# EAGLE design main_board (EAGLE 9.5.2)
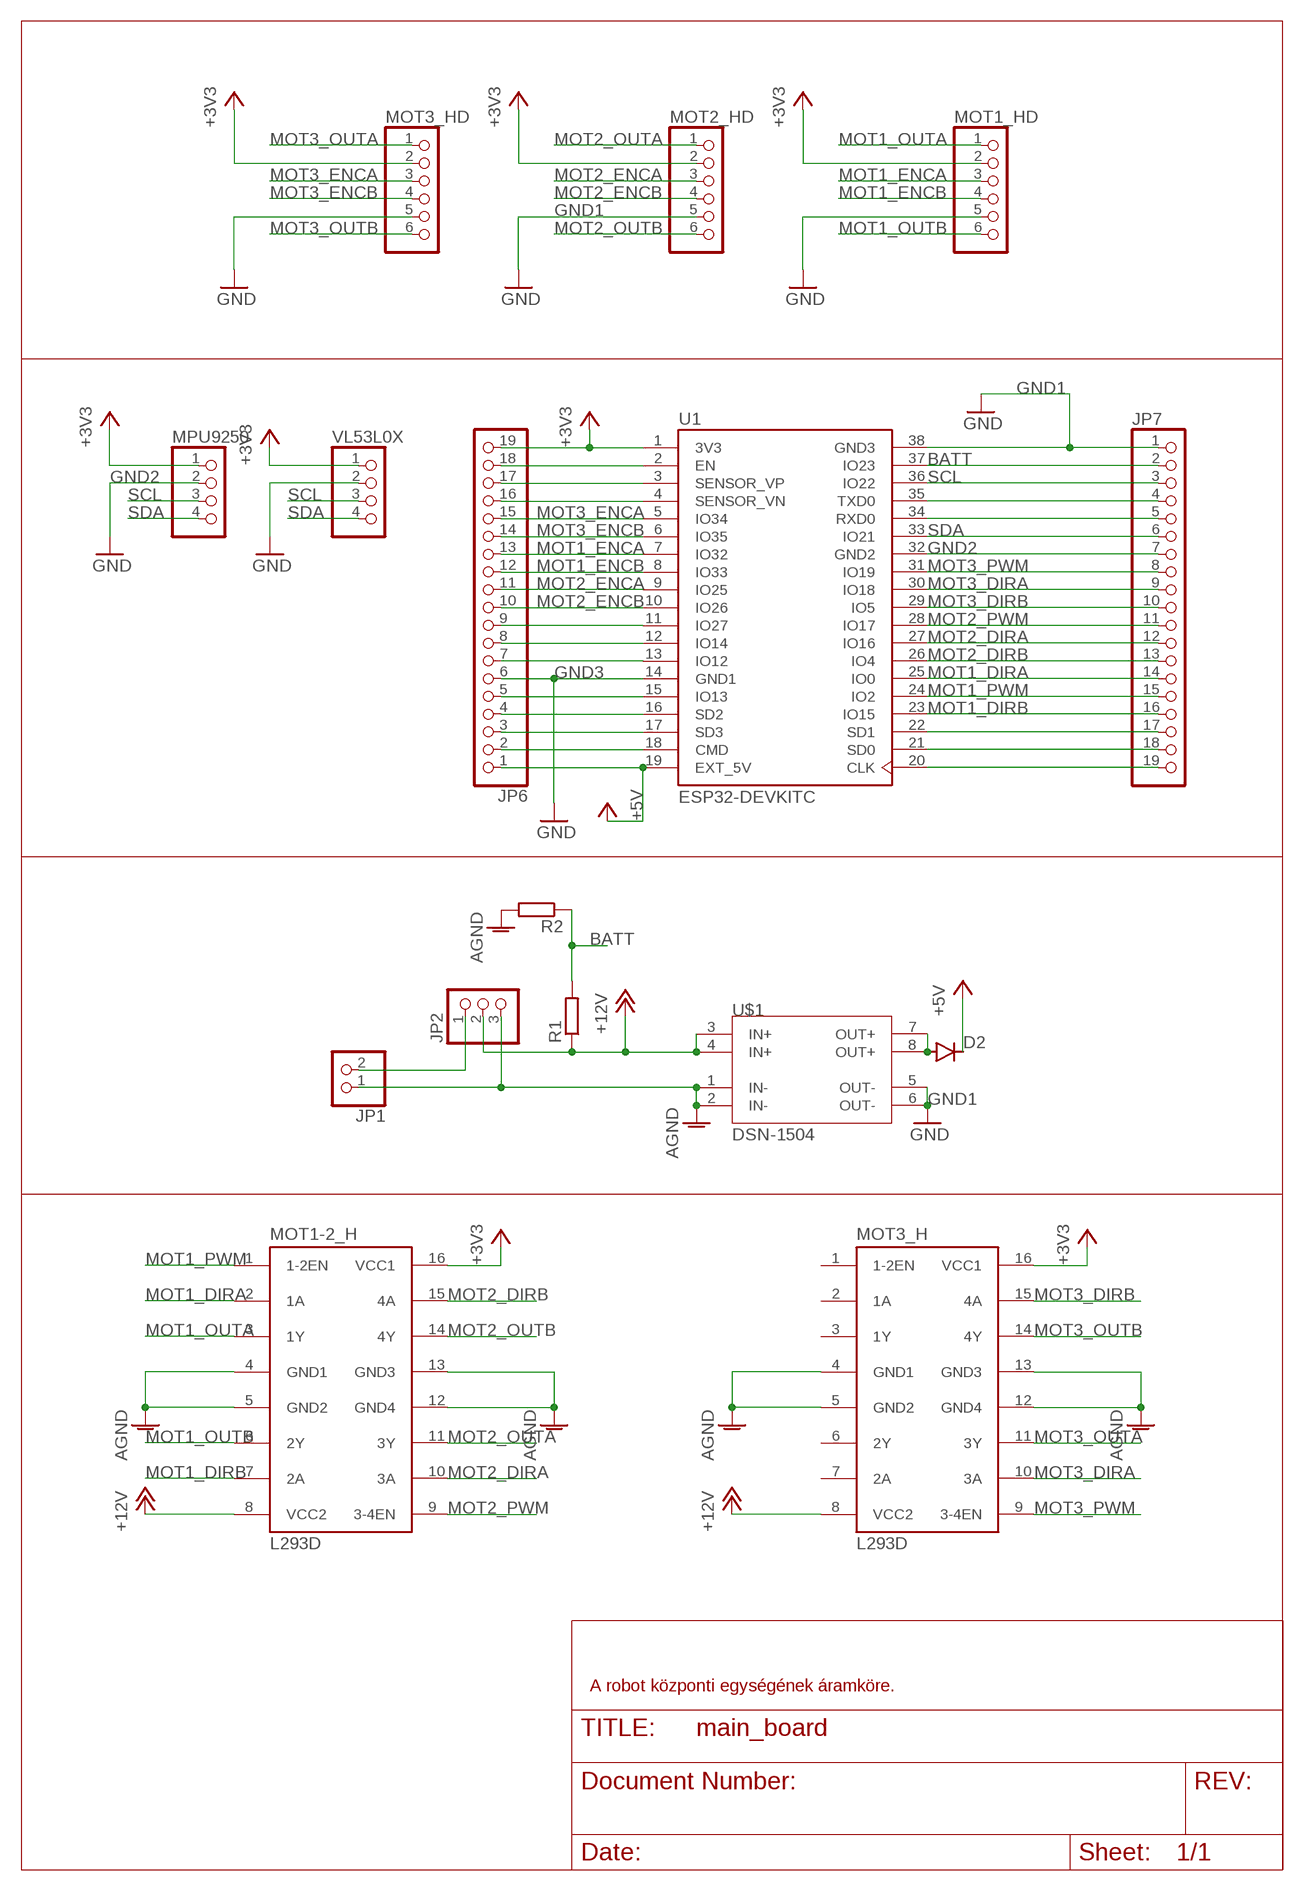
[diagram p0: schematic, sheet 1]

## Parts
D2  DIODE-DO27-15  [DO27-15]
JP1  PINHD-1X2  [1X02]
JP2  PINHD-1X3  [1X03]
JP6  PINHD-1X19  [1X19]
JP7  PINHD-1X19  [1X19]
MOT1-2_H  L293D  [DIL16]
MOT1_HD  PINHD-1X6  [1X06]
MOT2_HD  PINHD-1X6  [1X06]
MOT3_H  L293D  [DIL16]
MOT3_HD  PINHD-1X6  [1X06]
MPU9250  PINHD-1X4  [1X04]
R1  R-EU_R0805  [R0805]
R2  R-EU_R0805  [R0805]
U1  ESP32-DEVKITC  [MODULE_ESP32-DEVKITC]
U$1  DSN-1504  [DSN-1504]
VL53L0X  PINHD-1X4  [1X04]

## Nets
+3V3: JP6.19 MOT1-2_H.16(VCC1) MOT1_HD.2 MOT2_HD.2 MOT3_H.16(VCC1) MOT3_HD.2 MPU9250.1 U1.1(3V3) VL53L0X.1
+5V: D2.C JP6.1 U1.19(EXT_5V)
+12V: JP2.2 MOT1-2_H.8(VCC2) MOT3_H.8(VCC2) R1.1 U$1.3(IN+) U$1.4(IN+)
AGND: JP1.1 JP2.3 MOT1-2_H.4(GND1) MOT1-2_H.5(GND2) MOT1-2_H.12(GND4) MOT1-2_H.13(GND3) MOT3_H.4(GND1) MOT3_H.5(GND2) MOT3_H.12(GND4) MOT3_H.13(GND3) R2.2 U$1.1(IN-) U$1.2(IN-)
BATT: JP7.2 R1.2 R2.1 U1.37(IO23)
GND1: JP7.1 MOT2_HD.5 U1.38(GND3) U$1.5(OUT-) U$1.6(OUT-) ; supply symbol labelled GND
GND2: JP7.7 MPU9250.2 U1.32(GND2) ; supply symbol labelled GND
GND3: JP6.6 MOT1_HD.5 MOT3_HD.5 U1.14(GND1) VL53L0X.2 ; supply symbol labelled GND
MOT1_DIRA: JP7.14 MOT1-2_H.2(1A) U1.25(IO0)
MOT1_DIRB: JP7.16 MOT1-2_H.7(2A) U1.23(IO15)
MOT1_ENCA: JP6.13 MOT1_HD.3 U1.7(IO32)
MOT1_ENCB: JP6.12 MOT1_HD.4 U1.8(IO33)
MOT1_OUTA: MOT1-2_H.3(1Y) MOT1_HD.1
MOT1_OUTB: MOT1-2_H.6(2Y) MOT1_HD.6
MOT1_PWM: JP7.15 MOT1-2_H.1(1-2EN) U1.24(IO2)
MOT2_DIRA: JP7.12 MOT1-2_H.10(3A) U1.27(IO16)
MOT2_DIRB: JP7.13 MOT1-2_H.15(4A) U1.26(IO4)
MOT2_ENCA: JP6.11 MOT2_HD.3 U1.9(IO25)
MOT2_ENCB: JP6.10 MOT2_HD.4 U1.10(IO26)
MOT2_OUTA: MOT1-2_H.11(3Y) MOT2_HD.1
MOT2_OUTB: MOT1-2_H.14(4Y) MOT2_HD.6
MOT2_PWM: JP7.11 MOT1-2_H.9(3-4EN) U1.28(IO17)
MOT3_DIRA: JP7.9 MOT3_H.10(3A) U1.30(IO18)
MOT3_DIRB: JP7.10 MOT3_H.15(4A) U1.29(IO5)
MOT3_ENCA: JP6.15 MOT3_HD.3 U1.5(IO34)
MOT3_ENCB: JP6.14 MOT3_HD.4 U1.6(IO35)
MOT3_OUTA: MOT3_H.11(3Y) MOT3_HD.1
MOT3_OUTB: MOT3_H.14(4Y) MOT3_HD.6
MOT3_PWM: JP7.8 MOT3_H.9(3-4EN) U1.31(IO19)
N$1: JP6.2 U1.18(CMD)
N$2: JP6.3 U1.17(SD3)
N$3: JP6.4 U1.16(SD2)
N$4: JP1.2 JP2.1
N$5: D2.A U$1.7(OUT+) U$1.8(OUT+)
N$6: JP6.8 U1.12(IO14)
N$8: JP6.5 U1.15(IO13)
N$9: JP6.7 U1.13(IO12)
N$11: JP6.9 U1.11(IO27)
N$14: JP6.16 U1.4(SENSOR_VN)
N$15: JP6.17 U1.3(SENSOR_VP)
N$16: JP6.18 U1.2(EN)
N$22: JP7.4 U1.35(TXD0)
N$23: JP7.5 U1.34(RXD0)
N$34: JP7.17 U1.22(SD1)
N$35: JP7.18 U1.21(SD0)
N$36: JP7.19 U1.20(CLK)
SCL: JP7.3 MPU9250.3 U1.36(IO22) VL53L0X.3
SDA: JP7.6 MPU9250.4 U1.33(IO21) VL53L0X.4
Unconnected: MOT3_H.1(1-2EN) MOT3_H.2(1A) MOT3_H.3(1Y) MOT3_H.6(2Y) MOT3_H.7(2A)

## Notes on the sheet
- A robot központi egységének áramköre.

## Library data of the parts
D2 = diode:DIODE-: DIODE
JP1 = pinhead:PINHD-1X2: PIN HEADER
JP2 = pinhead:PINHD-1X3: PIN HEADER
JP6 JP7 = pinhead:PINHD-1X19: PIN HEADER
MOT1-2_H MOT3_H = st-microelectronics:L293D: PUSH-PULL 4 CHANNEL DRIVER; MPN: L293D; OC_FARNELL: 9589619; OC_NEWARK: 56P8249
MOT1_HD MOT2_HD MOT3_HD = pinhead:PINHD-1X6: PIN HEADER
MPU9250 VL53L0X = pinhead:PINHD-1X4: PIN HEADER
R1 R2 = rcl:R-EU_: RESISTOR, European symbol; SPICEPREFIX: R
U1 = ESP32-DEVKITC:ESP32-DEVKITC: ESP32-DEVKITC; AVAILABILITY: Unavailable; DESCRIPTION: - Transceiver; 802.11 b/g/n _Wi-Fi, WiFi, WLAN_, Bluetooth® Smart 4.x Low Energy _BLE_ For Use With ESP32-WROOM32; MF: Espressif Systems; MP: ESP32-DevKitC; PACKAGE: None; PRICE: None
U$1 = untitled:DSN-1504

## Board
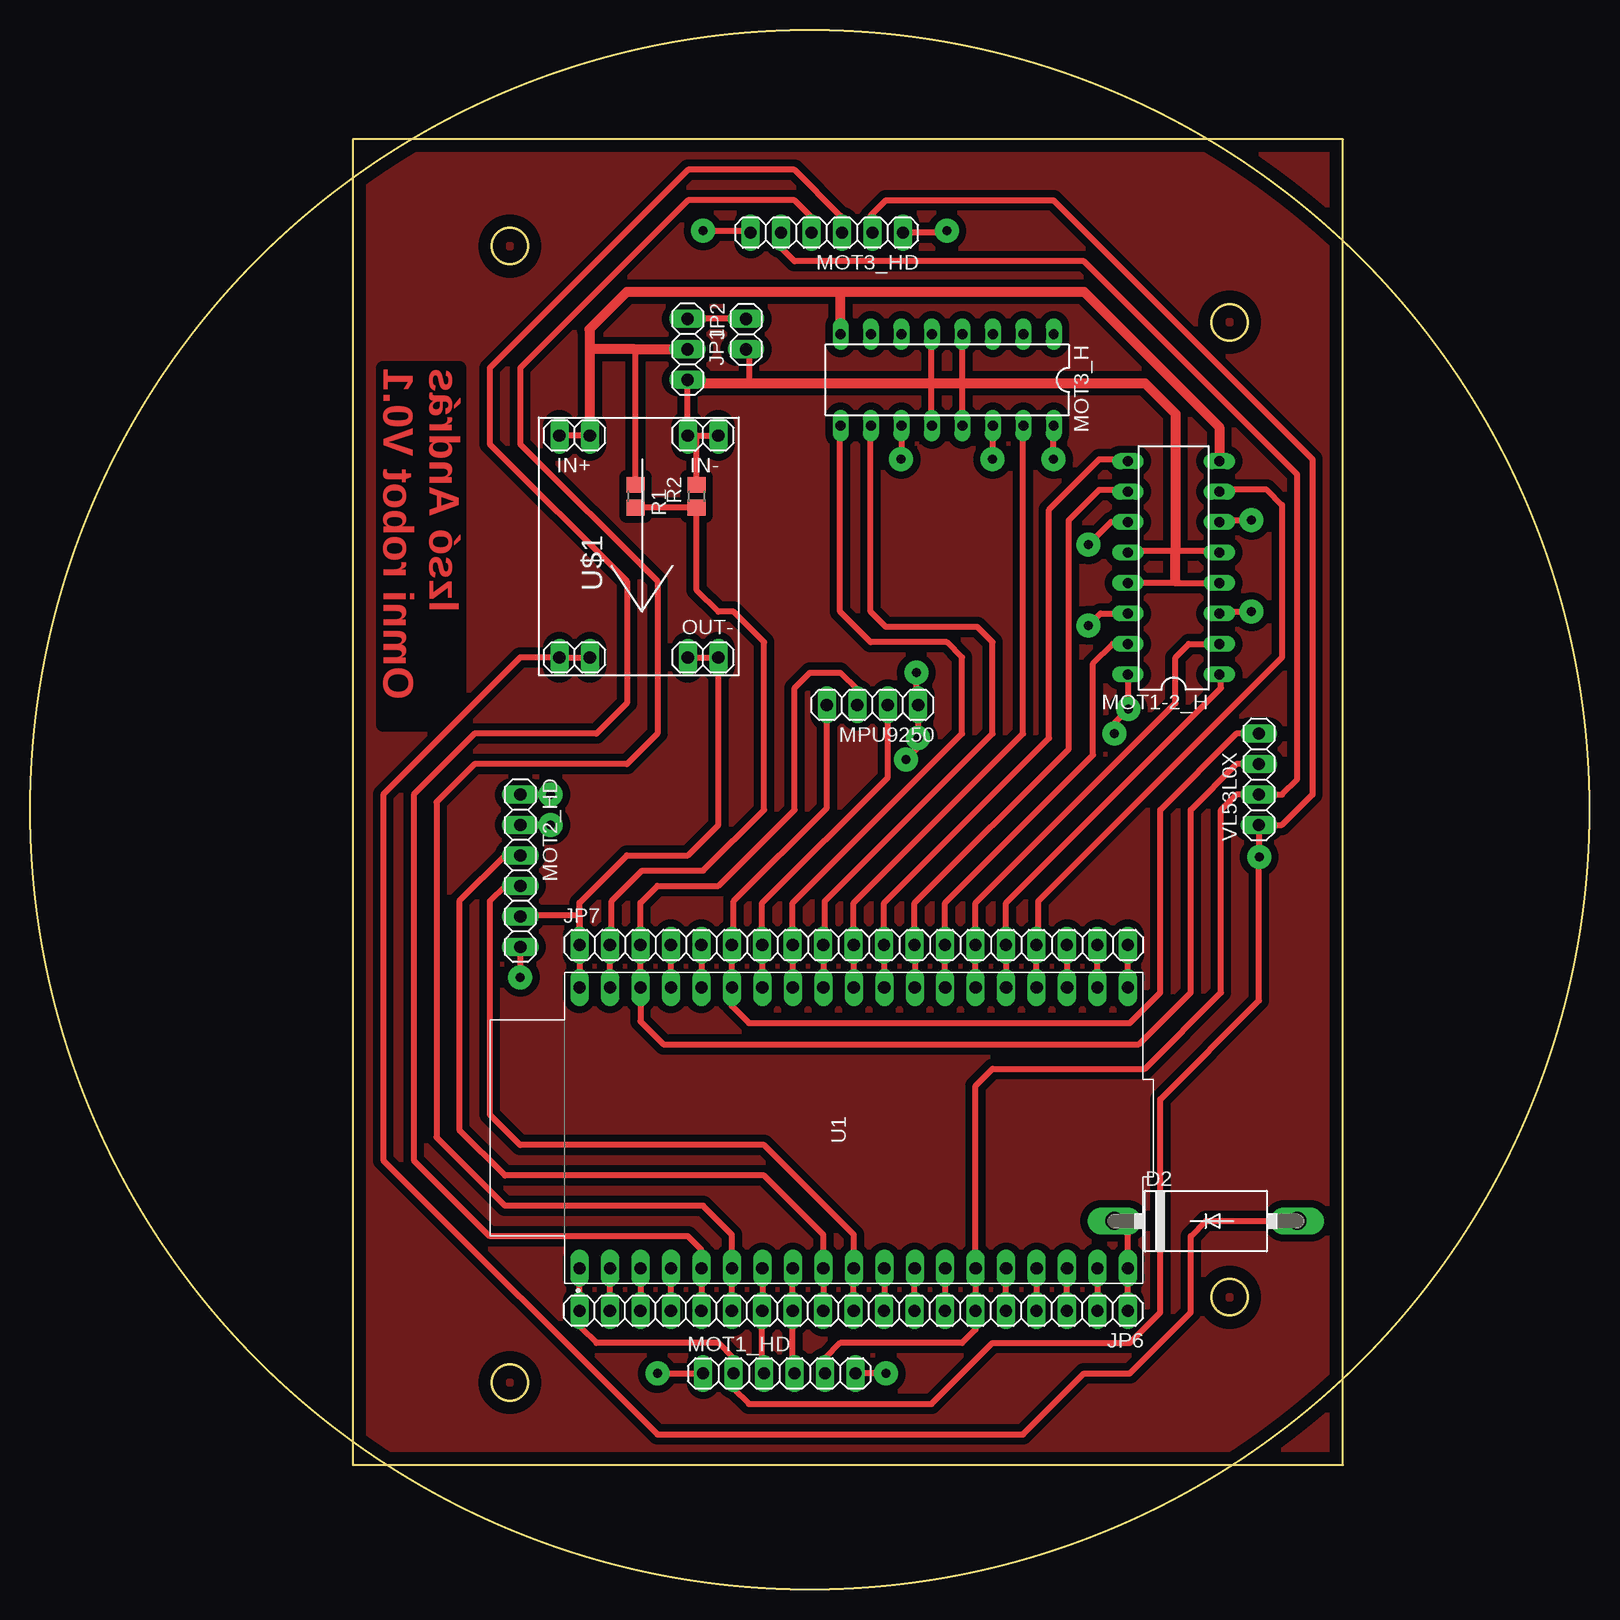
[diagram p1: board, top side]
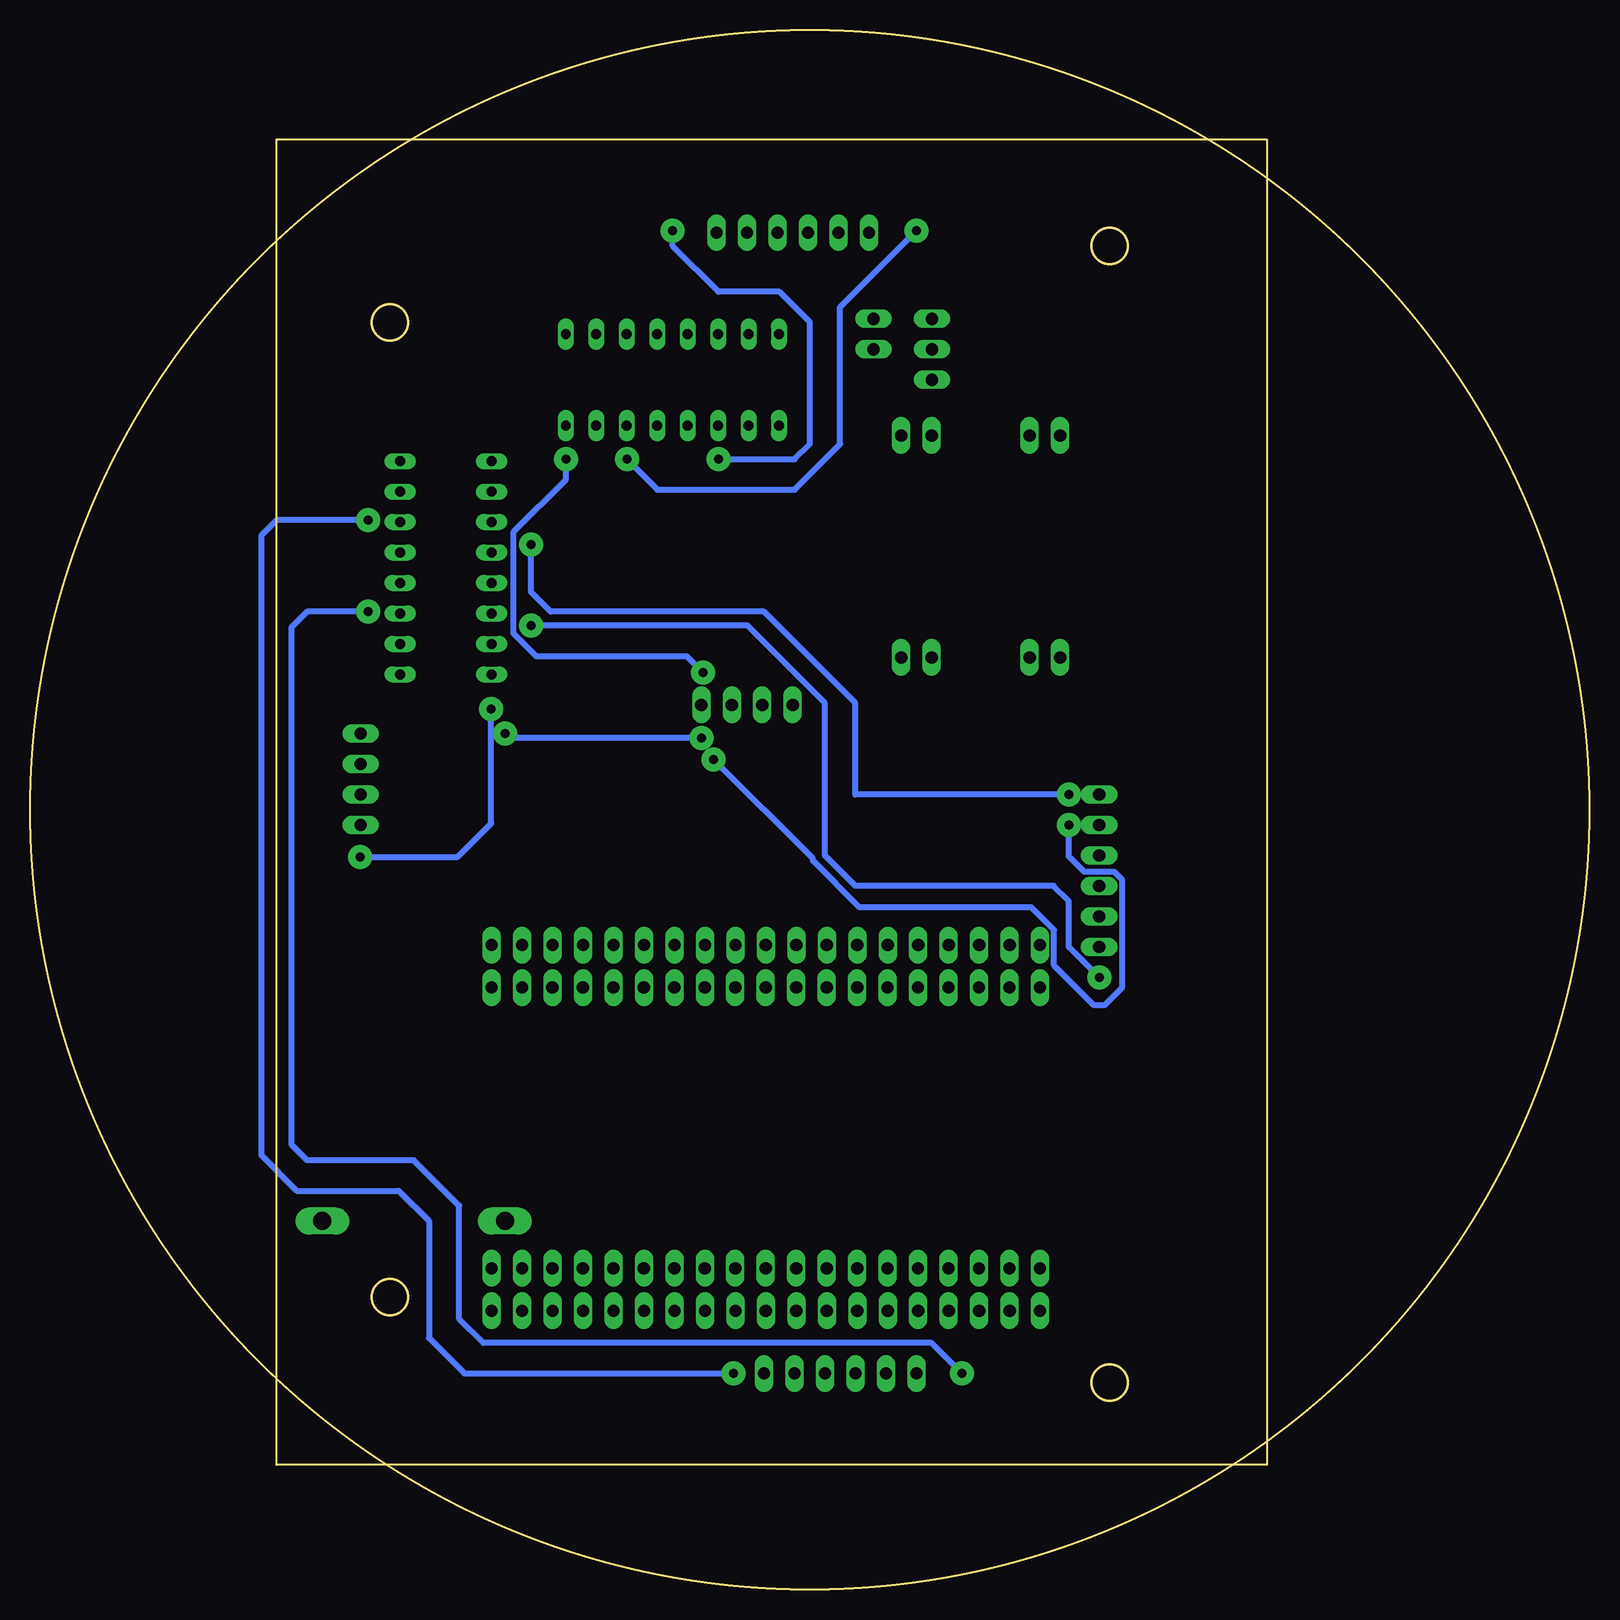
[diagram p2: board, bottom side, seen from below]

Size 130 x 130 mm. Coordinates in mm from the lower left corner, seen from the top.
Outline: 26.9,120.88 26.9,10.39 109.45,10.39 109.45,120.88 26.9,120.88
Outline: circle at 40,111.99 radius 1.5
Outline: circle at 40,17.25 radius 1.5
Outline: circle at 100,24.36 radius 1.5
Outline: circle at 100,105.64 radius 1.5
Outline: circle at 65,65 radius 65
Copper layers (1*16): Top 0.035mm / dielectric 1.5mm / Bottom 0.035mm
Design rules "default *": minimum track width 6mil, minimum drill 0.35mm, track to track 20mil, track to pad 6mil, pad to pad 6mil, via to via 6mil, smd to smd 6mil, copper to edge 40mil, drill to drill 6mil, minimum pad ring 10mil, minimum via ring 8mil, stop-mask expansion 4mil, vias tented up to drill 0mil, thermal gap 10mil

### Footprints (pad centres in the part's own frame; a part is rotated, then mirrored left to right if it is on the bottom)
DO27-15 = drill 1.499 long: A 7.62,0; C -7.62,0
1X02 = drill 1.016 long: 1 -1.27,0; 2 1.27,0
1X03 = drill 1.016 long: 1 -2.54,0; 2 0,0; 3 2.54,0
1X19 = drill 1.016 long: 1 -22.86,0; 2 -20.32,0; 3 -17.78,0; 4 -15.24,0; 5 -12.7,0; 6 -10.16,0; 7 -7.62,0; 8 -5.08,0; 9 -2.54,0; 10 0,0; 11 2.54,0; 12 5.08,0; 13 7.62,0; 14 10.16,0; 15 12.7,0; 16 15.24,0; 17 17.78,0; 18 20.32,0; 19 22.86,0
DIL16 = drill 0.813 long: 1 -8.89,-3.81; 2 -6.35,-3.81; 3 -3.81,-3.81; 4 -1.27,-3.81; 5 1.27,-3.81; 6 3.81,-3.81; 7 6.35,-3.81; 8 8.89,-3.81; 9 8.89,3.81; 10 6.35,3.81; 11 3.81,3.81; 12 1.27,3.81; 13 -1.27,3.81; 14 -3.81,3.81; 15 -6.35,3.81; 16 -8.89,3.81
1X06 = drill 1.016 long: 1 -6.35,0; 2 -3.81,0; 3 -1.27,0; 4 1.27,0; 5 3.81,0; 6 6.35,0
1X04 = drill 1.016 long: 1 -3.81,0; 2 -1.27,0; 3 1.27,0; 4 3.81,0
R0805 = smd 1.3 x 1.5: 1 -0.95,0; 2 0.95,0
MODULE_ESP32-DEVKITC = drill 1.02 long: 1 -11.7,22.85; 2 -11.7,20.31; 3 -11.7,17.77; 4 -11.7,15.23; 5 -11.7,12.69; 6 -11.7,10.15; 7 -11.7,7.61; 8 -11.7,5.07; 9 -11.7,2.53; 10 -11.7,-0.01; 11 -11.7,-2.55; 12 -11.7,-5.09; 13 -11.7,-7.63; 14 -11.7,-10.17; 15 -11.7,-12.71; 16 -11.7,-15.25; 17 -11.7,-17.79; 18 -11.7,-20.33; 19 -11.7,-22.87; 20 11.7,-22.87; 21 11.7,-20.33; 22 11.7,-17.79; 23 11.7,-15.25; 24 11.7,-12.71; 25 11.7,-10.17; 26 11.7,-7.63; 27 11.7,-5.09; 28 11.7,-2.55; 29 11.7,-0.01; 30 11.7,2.53; 31 11.7,5.07; 32 11.7,7.61; 33 11.7,10.15; 34 11.7,12.69; 35 11.7,15.23; 36 11.7,17.77; 37 11.7,20.31; 38 11.7,22.85
DSN-1504 = drill 1.016 long: 1 -8.34,6.35; 2 -8.34,3.81; 3 -8.34,-4.36; 4 -8.34,-6.9; 5 10.16,6.35; 6 10.16,3.81; 7 10.16,-4.36; 8 10.16,-6.9

### Placement (x,y rotation side)
D2  98.02,30.71 0 top
JP1  59.69,104.65 90 top
JP2  54.82,103.38 270 top
JP6  68.66,23.24 180 top
JP7  68.66,53.72 0 top
MOT1-2_H  95.33,85.17 90 top
MOT1_HD  62.46,18.01 0 top
MOT2_HD  40.87,59.92 270 top
MOT3_H  76.45,100.84 180 top
MOT3_HD  66.42,113.11 180 top
MPU9250  70.23,73.74 180 top
R1  50.5,91.14 270 top
R2  55.58,91.14 90 top
U1  68.66,38.48 90 top
U$1  51.03,87.86 270 top
VL53L0X  102.44,67.54 90 top

### Tracks (layer width: path | path; a pad name or v marks a point on that pad's centre or on a via)
+3V3  (via drill 0.75 pad 2)
  Top 0.508: U1.1 45.81,27.03 45.8,27.04 JP6.19 45.95,23.09 45.95,21.82 47.22,20.55 57.38,20.55 58.65,19.28 MOT1_HD.2 58.65,16.74 59.92,15.47 75.16,15.47 80.24,20.55 91.67,20.55 94.21,23.09 94.21,40.87 102.44,49.1 102.44,61.09 | MOT3_HD.2 70.08,113.26 70.08,114.53 71.35,115.8 85.32,115.8 106.91,94.21 106.91,66.27 104.37,63.73 VL53L0X.1 102.44,61.09 | 102.44,61.09 v102.47,61.06 | MOT1-2_H.16 91.54,76.26 v91.54,73.38 90.4,72.24 v90.4,71.35 | v73,69.19 74.02,70.21 v74.02,70.97 74.04,70.99 MPU9250.1 73.89,73.89 v73.89,76.43 | v43.41,63.73 MOT2_HD.2 | v85.32,94.21 85.32,97 MOT3_H.16
  Bottom 0.508: v102.47,61.06 94.34,61.06 91.54,63.86 v91.54,73.38 | v74.02,70.97 90.02,70.97 v90.4,71.35 | v73,69.19 64.75,60.94 64.75,60.77 60.85,56.87 46.53,56.87 44.63,54.97 44.63,52.03 41.31,48.7 40.43,48.7 38.94,50.2 38.94,59.13 39.62,59.82 42.12,59.82 43.41,61.11 v43.41,63.73 | v73.89,76.43 75.25,77.79 87.79,77.79 89.68,79.67 89.68,88.17 85.32,92.53 v85.32,94.21
+5V
  Top 0.508: JP6.1 91.52,27.04 91.53,27.03 U1.19 91.53,29.58 D2.C
+12V
  Top 0.508: R1.1 50.5,103.27 50.39,103.38 | 67.56,108.16 67.54,108.18 | U$1.3 U$1.4 | 46.67,104.97 46.61,105.03 | 46.69,103.38 46.67,103.35
  Top 0.813: JP2.2 51.03,103.38 50.39,103.38 46.69,103.38 | MOT1-2_H.8 99.14,96.9 87.86,108.18 67.54,108.18 49.76,108.18 46.61,105.03 | MOT3_H.8 67.56,108.16 | U$1.3 46.67,103.35 46.67,104.97
AGND
  Top 0.508: 55.6,96.2 U$1.2 54.82,96.22 JP2.3 55.09,100.56 | 55.6,96.2 U$1.1 | R2.2 55.58,96.18 55.6,96.2 | 59.92,100.56 59.92,103.15 JP1.1 | 77.7,100.56 77.72,100.58 | 77.72,100.58 MOT3_H.4 | MOT3_H.13 77.72,100.58 | MOT3_H.12 75.16,97.05 75.16,100.56 75.16,104.62 MOT3_H.5 | MOT1-2_H.13 95.33,83.9 95.48,84.05 95.63,83.9 MOT1-2_H.4 | MOT1-2_H.12 91.67,86.59 95.48,86.59 98.99,86.59 MOT1-2_H.5
  Top 0.813: 55.09,100.56 59.92,100.56 75.16,100.56 77.7,100.56 92.94,100.56 95.48,98.02 95.48,86.59 95.48,84.05
BATT
  Top 0.508: R1.2 R2.1 55.58,83.31 57.38,81.51 58.65,81.51 61.19,78.97 61.19,65 56.11,59.92 51.03,59.92 48.49,57.38 48.49,53.87 JP7.2 U1.37
GND
  pour Top (isolate 0.61): 109.45,10.39 26.9,10.39 26.9,120.88 109.45,120.88
GND1
  Top 0.508: JP7.1 45.8,57.23 49.76,61.19 54.84,61.19 57.38,63.73 U$1.5 U$1.6 | JP7.1 45.81,56.25 41.01,56.25 MOT2_HD.5 | JP7.1 U1.38
GND2
  Top 0.508: MPU9250.2 71.5,67.69 61.04,57.23 JP7.7 U1.32
GND3
  Top 0.508: MOT1_HD.5 66.27,19.28 67.54,20.55 77.7,20.55 78.82,21.67 JP6.6 U1.14 78.83,42 80.24,43.41 92.94,43.41 99.29,49.76 99.29,65 100.56,66.27 VL53L0X.2 104.37,66.27 105.64,67.54 105.64,92.94 87.86,110.72 63.73,110.72 62.61,111.84 MOT3_HD.5
MOT1_DIRA
  Top 0.508: MOT1-2_H.2 96.6,78.82 95.48,77.7 95.48,73.89 78.82,57.23 JP7.14 U1.25
MOT1_DIRB
  Top 0.508: MOT1-2_H.7 99.29,91.67 103.1,91.67 104.37,90.4 104.37,77.7 84.05,57.38 84.05,53.87 JP7.16 U1.23
MOT1_ENCA
  Top 0.508: MOT1_HD.3 61.04,18.16 JP6.13 U1.7
MOT1_ENCB
  Top 0.508: MOT1_HD.4 63.58,18.16 JP6.12 63.58,27.04 63.59,27.03 U1.8
MOT1_OUTA  (via drill 0.75 pad 2)
  Top 0.508: MOT1-2_H.3 99.29,81.51 v101.83,81.51 | v52.3,18.01 MOT1_HD.1
  Bottom 0.508: v101.83,81.51 106.91,81.51 108.18,80.24 108.18,37.06 106.91,35.79 98.02,35.79 94.21,31.98 94.21,22.57 92.19,20.55 54.84,20.55 v52.3,18.01
MOT1_OUTB  (via drill 0.75 pad 2)
  Top 0.508: MOT1-2_H.6 99.29,89.13 v101.83,89.13 | v71.35,18.01 MOT1_HD.6
  Bottom 0.508: v101.83,89.13 109.45,89.13 110.72,87.86 110.72,36.22 107.75,33.25 99.29,33.25 96.75,30.71 96.75,20.98 93.78,18.01 v71.35,18.01
MOT1_PWM
  Top 0.508: MOT1-2_H.1 99.29,76.13 99.29,75.16 81.36,57.23 JP7.15 U1.24
MOT2_DIRA
  Top 0.508: MOT1-2_H.10 91.37,91.67 89.13,91.67 86.59,89.13 86.59,70.08 73.74,57.23 JP7.12 U1.27
MOT2_DIRB
  Top 0.508: MOT1-2_H.15 90.25,78.82 88.62,77.19 88.62,69.57 76.28,57.23 JP7.13 U1.26
MOT2_ENCA
  Top 0.508: MOT2_HD.3 39.6,61.19 35.79,57.38 35.79,38.33 39.6,34.52 61.19,34.52 66.13,29.58 U1.9 JP6.11
MOT2_ENCB
  Top 0.508: MOT2_HD.4 39.6,58.65 38.33,57.38 38.33,39.6 40.87,37.06 61.19,37.06 68.67,29.58 U1.10 68.67,27.03 68.66,27.04 JP6.10
MOT2_OUTA  (via drill 0.75 pad 2)
  Top 0.508: MOT2_HD.1 v43.41,66.27 | v88.24,87.1 90.12,88.98 MOT1-2_H.11
  Bottom 0.508: v43.41,66.27 61.19,66.27 61.19,73.89 68.81,81.51 86.59,81.51 88.24,83.16 v88.24,87.1
MOT2_OUTB  (via drill 0.75 pad 2)
  Top 0.508: MOT2_HD.6 v40.87,51.03 | v88.24,80.37 89.23,81.36 MOT1-2_H.14
  Bottom 0.508: v40.87,51.03 43.41,53.57 43.41,57.38 44.68,58.65 61.19,58.65 63.73,61.19 63.73,73.89 70.21,80.37 v88.24,80.37
MOT2_PWM
  Top 0.508: MOT1-2_H.9 91.37,94.21 89.13,94.21 84.94,90.02 84.94,70.97 71.2,57.23 JP7.11 U1.28
MOT3_DIRA
  Top 0.508: MOT3_H.10 70.08,97 70.08,81.51 71.35,80.24 78.97,80.24 80.24,78.97 80.24,71.35 66.27,57.38 66.27,53.87 JP7.9 U1.30
MOT3_DIRB
  Top 0.508: MOT3_H.15 82.78,97 82.78,71.35 68.66,57.23 JP7.10 U1.29
MOT3_ENCA
  Top 0.508: MOT3_HD.3 67.54,113.26 67.54,114.53 63.73,118.34 54.84,118.34 38.33,101.83 38.33,95.48 49.76,84.05 49.76,73.89 47.22,71.35 37.06,71.35 31.98,66.27 31.98,35.79 38.33,29.44 54.84,29.44 55.97,28.31 U1.5 JP6.15
MOT3_ENCB
  Top 0.508: MOT3_HD.4 65,113.26 65,114.53 63.73,115.8 54.84,115.8 40.87,101.83 40.87,95.48 52.3,84.05 52.3,71.35 49.76,68.81 37.06,68.81 33.89,65.64 33.89,37.7 39.6,31.98 56.11,31.98 58.51,29.58 U1.6 58.51,27.03 58.5,27.04 JP6.14
MOT3_OUTA  (via drill 0.75 pad 2)
  Top 0.508: MOT3_H.11 72.64,94.23 v72.62,94.21 | v76.43,113.26 76.28,113.11 MOT3_HD.1
  Bottom 0.508: v76.43,113.26 76.43,111.99 72.62,108.18 67.54,108.18 65,105.64 65,95.48 66.27,94.21 v72.62,94.21
MOT3_OUTB  (via drill 0.75 pad 2)
  Top 0.508: MOT3_H.14 80.24,97 v80.24,94.21 | v56.11,113.26 59.92,113.26 MOT3_HD.6
  Bottom 0.508: v80.24,94.21 77.7,91.67 66.27,91.67 62.46,95.48 62.46,106.91 v56.11,113.26
MOT3_PWM
  Top 0.508: MOT3_H.9 67.54,97 67.54,81.51 70.08,78.97 76.43,78.97 77.7,77.7 77.7,71.35 63.58,57.23 JP7.8 U1.31
N$1
  Top 0.508: U1.18 JP6.2
N$2
  Top 0.508: JP6.3 86.44,27.04 86.45,27.03 U1.17
N$3
  Top 0.508: U1.16 JP6.4
N$4
  Top 0.508: JP1.2 JP2.1
N$5
  Top 0.508: U$1.7 U$1.8 40.87,77.7 29.44,66.27 29.44,35.79 52.3,12.93 82.78,12.93 87.86,18.01 91.67,18.01 96.75,23.09 96.75,29.44 98.02,30.71 D2.A
N$6
  Top 0.508: JP6.8 73.74,27.04 73.75,27.03 U1.12
N$8
  Top 0.508: JP6.5 81.36,27.04 81.37,27.03 U1.15
N$9
  Top 0.508: U1.13 JP6.7
N$11
  Top 0.508: U1.11 JP6.9
N$14
  Top 0.508: JP6.16 53.42,27.04 53.43,27.03 U1.4
N$15
  Top 0.508: U1.3 JP6.17
N$16
  Top 0.508: JP6.18 48.34,27.04 48.35,27.03 U1.2
N$22
  Top 0.508: U1.35 JP7.4
N$23
  Top 0.508: JP7.5 U1.34
N$34
  Top 0.508: JP7.17 U1.22
N$35
  Top 0.508: U1.21 JP7.18
N$36
  Top 0.508: U1.20 JP7.19
SCL
  Top 0.508: MPU9250.3 68.96,75.01 67.54,76.43 65,76.43 63.73,75.16 63.73,65 57.38,58.65 52.3,58.65 50.88,57.23 JP7.3 U1.36 50.89,47.36 52.81,45.44 92.43,45.44 96.75,49.76 96.75,65 100.56,68.81 VL53L0X.3
SDA
  Top 0.508: MPU9250.4 66.42,65.15 58.65,57.38 58.65,53.87 JP7.6 U1.33 58.51,48.63 59.92,47.22 91.67,47.22 94.21,49.76 94.21,65 100.56,71.35 VL53L0X.4

### Text on the board
Top: Izsó András / Omni robot V0.1